# Altium schematic sheet MOSFET_Switch_Serial.SchDoc
size A4
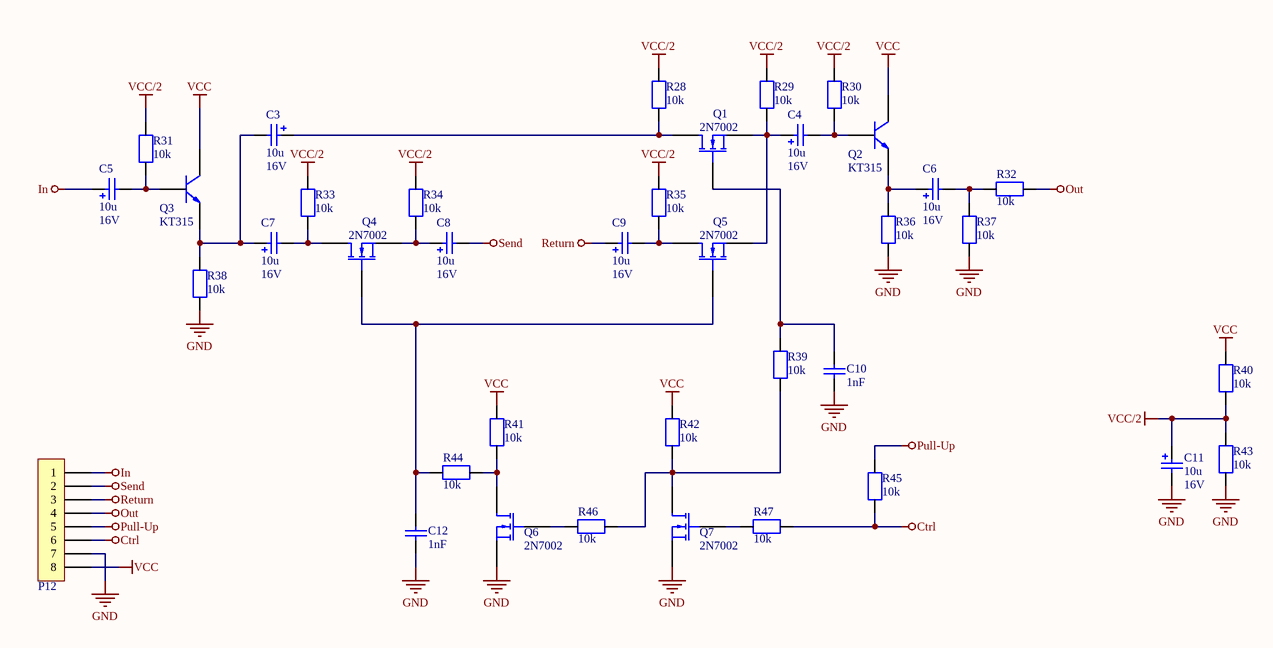
[diagram p0: MOSFET_Switch_Serial.SchDoc]

## Parts
C3  value 10u  Initial Voltage: 16V  [ELEC_RAD10]  (hidden comment: Electrolytic Capacitor)
C4  value 10u  Initial Voltage: 16V  [ELEC_RAD10]  (hidden comment: Electrolytic Capacitor)
C5  value 10u  Initial Voltage: 16V  [ELEC_RAD10]  (hidden comment: Electrolytic Capacitor)
C6  value 10u  Initial Voltage: 16V  [ELEC_RAD10]  (hidden comment: Electrolytic Capacitor)
C7  value 10u  Initial Voltage: 16V  [ELEC_RAD10]  (hidden comment: Electrolytic Capacitor)
C8  value 10u  Initial Voltage: 16V  [ELEC_RAD10]  (hidden comment: Electrolytic Capacitor)
C9  value 10u  Initial Voltage: 16V  [ELEC_RAD10]  (hidden comment: Electrolytic Capacitor)
C10  value 1nF  [0805_Capacitor]  (hidden comment: Capacitor)
C11  value 10u  Initial Voltage: 16V  [ELEC_RAD10]  (hidden comment: Electrolytic Capacitor)
C12  value 1nF  [0805_Capacitor]  (hidden comment: Capacitor)
P12  SIL-CONN-8  [SIL-CONN-8-R1]  (value not drawn)
Q1  2N7002  [SOT23-3]
Q2  KT315  [KT315]
Q3  KT315  [KT315]
Q4  2N7002  [SOT23-3]
Q5  2N7002  [SOT23-3]
Q6  2N7002  [SOT23-3]
Q7  2N7002  [SOT23-3]
R28  value 10k  [0805_Resistor]  (hidden comment: Resistor)
R29  value 10k  [0805_Resistor]  (hidden comment: Resistor)
R30  value 10k  [0805_Resistor]  (hidden comment: Resistor)
R31  value 10k  [0805_Resistor]  (hidden comment: Resistor)
R32  value 10k  [0805_Resistor]  (hidden comment: Resistor)
R33  value 10k  [0805_Resistor]  (hidden comment: Resistor)
R34  value 10k  [0805_Resistor]  (hidden comment: Resistor)
R35  value 10k  [0805_Resistor]  (hidden comment: Resistor)
R36  value 10k  [0805_Resistor]  (hidden comment: Resistor)
R37  value 10k  [0805_Resistor]  (hidden comment: Resistor)
R38  value 10k  [0805_Resistor]  (hidden comment: Resistor)
R39  value 10k  [0805_Resistor]  (hidden comment: Resistor)
R40  value 10k  [0805_Resistor]  (hidden comment: Resistor)
R41  value 10k  [0805_Resistor]  (hidden comment: Resistor)
R42  value 10k  [0805_Resistor]  (hidden comment: Resistor)
R43  value 10k  [0805_Resistor]  (hidden comment: Resistor)
R44  value 10k  [0805_Resistor]  (hidden comment: Resistor)
R45  value 10k  [0805_Resistor]  (hidden comment: Resistor)
R46  value 10k  [0805_Resistor]  (hidden comment: Resistor)
R47  value 10k  [0805_Resistor]  (hidden comment: Resistor)

## Nets
Ctrl: P12.6 R45.1 R47.1
GND: C10.1 C11.- C12.1 P12.7 Q6.S Q7.S R36.1 R37.1 R38.1 R43.1
In: C5.+ P12.1
Out: P12.4 R32.1
Pull-Up: P12.5 R45.2
Return: C9.+ P12.3
Send: C8.- P12.2
VCC: P12.8 Q2.K Q3.K R40.2 R41.1 R42.1
VCC/2: C11.+ R28.2 R29.2 R30.2 R31.2 R33.2 R34.2 R35.2 R40.1 R43.2
NetC3_+: C3.+ Q1.D R28.1
NetC3_-: C3.- C7.+ Q3.E R38.2
NetC4_+: C4.+ Q1.S Q5.S R29.1
NetC4_-: C4.- Q2.B R30.1
NetC5_-: C5.- Q3.B R31.1
NetC6_+: C6.+ Q2.E R36.2
NetC6_-: C6.- R32.2 R37.2
NetC7_-: C7.- Q4.D R33.1
NetC8_+: C8.+ Q4.S R34.1
NetC9_-: C9.- Q5.D R35.1
NetC10_2: C10.2 Q1.G R39.2
NetC12_2: C12.2 Q4.G Q5.G R44.1
NetQ6_D: Q6.D R41.2 R44.2
NetQ6_G: Q6.G R46.1
NetQ7_D: Q7.D R39.1 R42.2 R46.2
NetQ7_G: Q7.G R47.2

## Library data of the parts
Q1 Q4-Q7 = 2N7002: pin to pad: D>1 G>2 S>3
Q2 Q3 = KT315: pin to pad: B>3 E>1 K>2